# EAGLE schematic ESP32-S3 4G LTE CAT1 V1.1 (EAGLE 6.1)
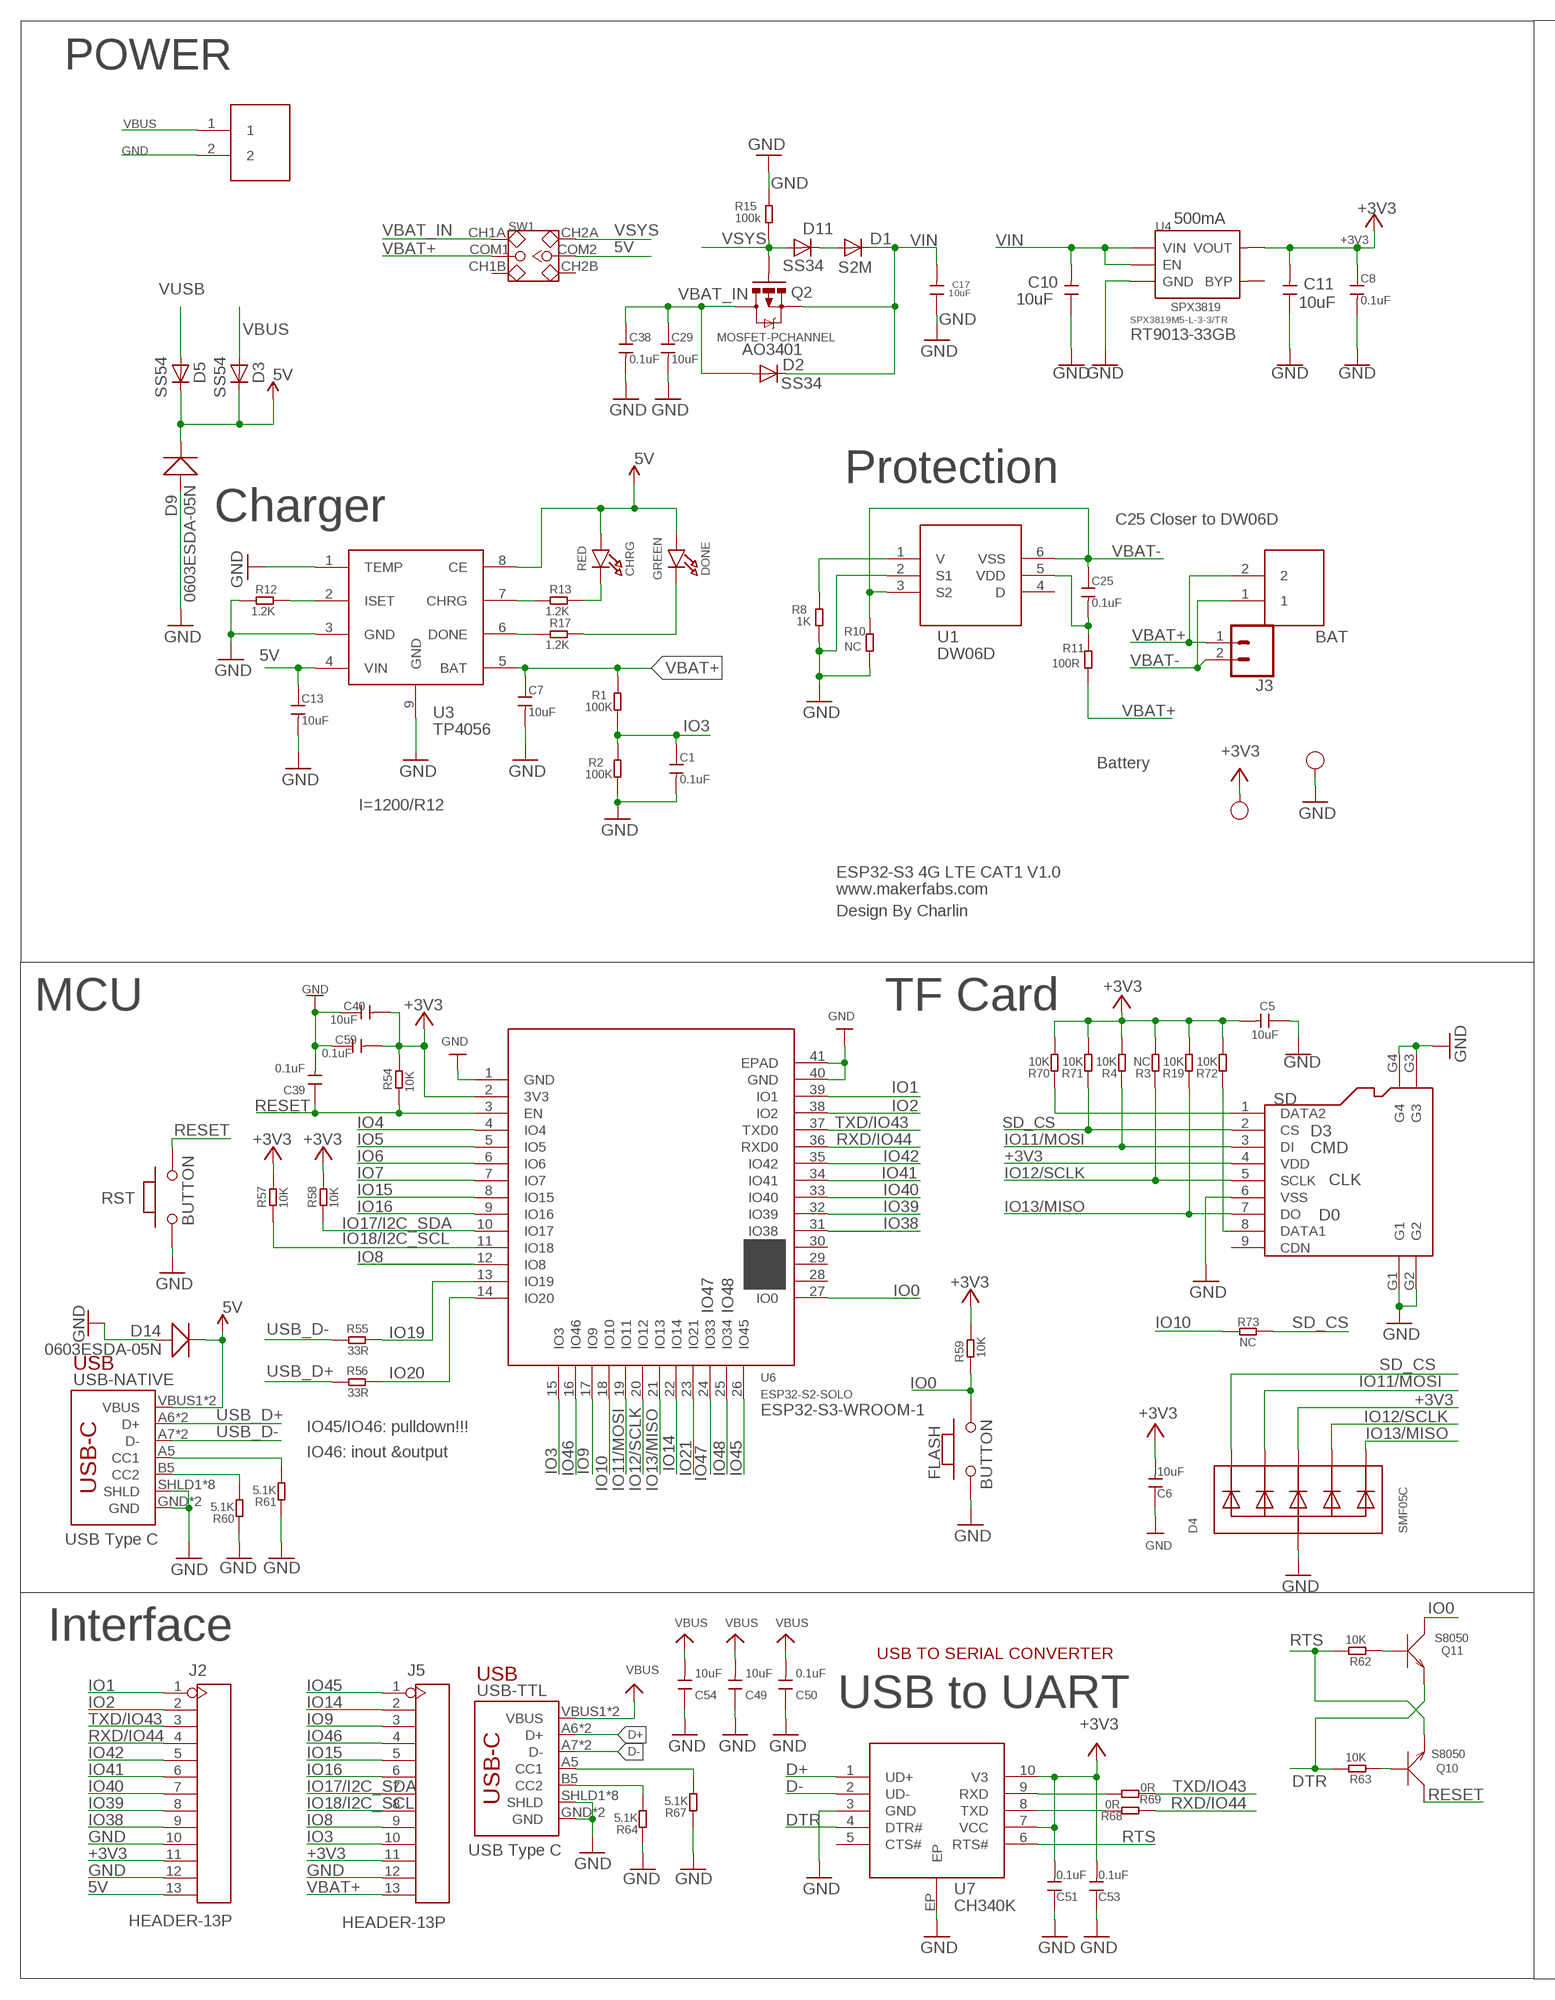
[diagram p0: schematic, sheet 1, part 1 of 2]
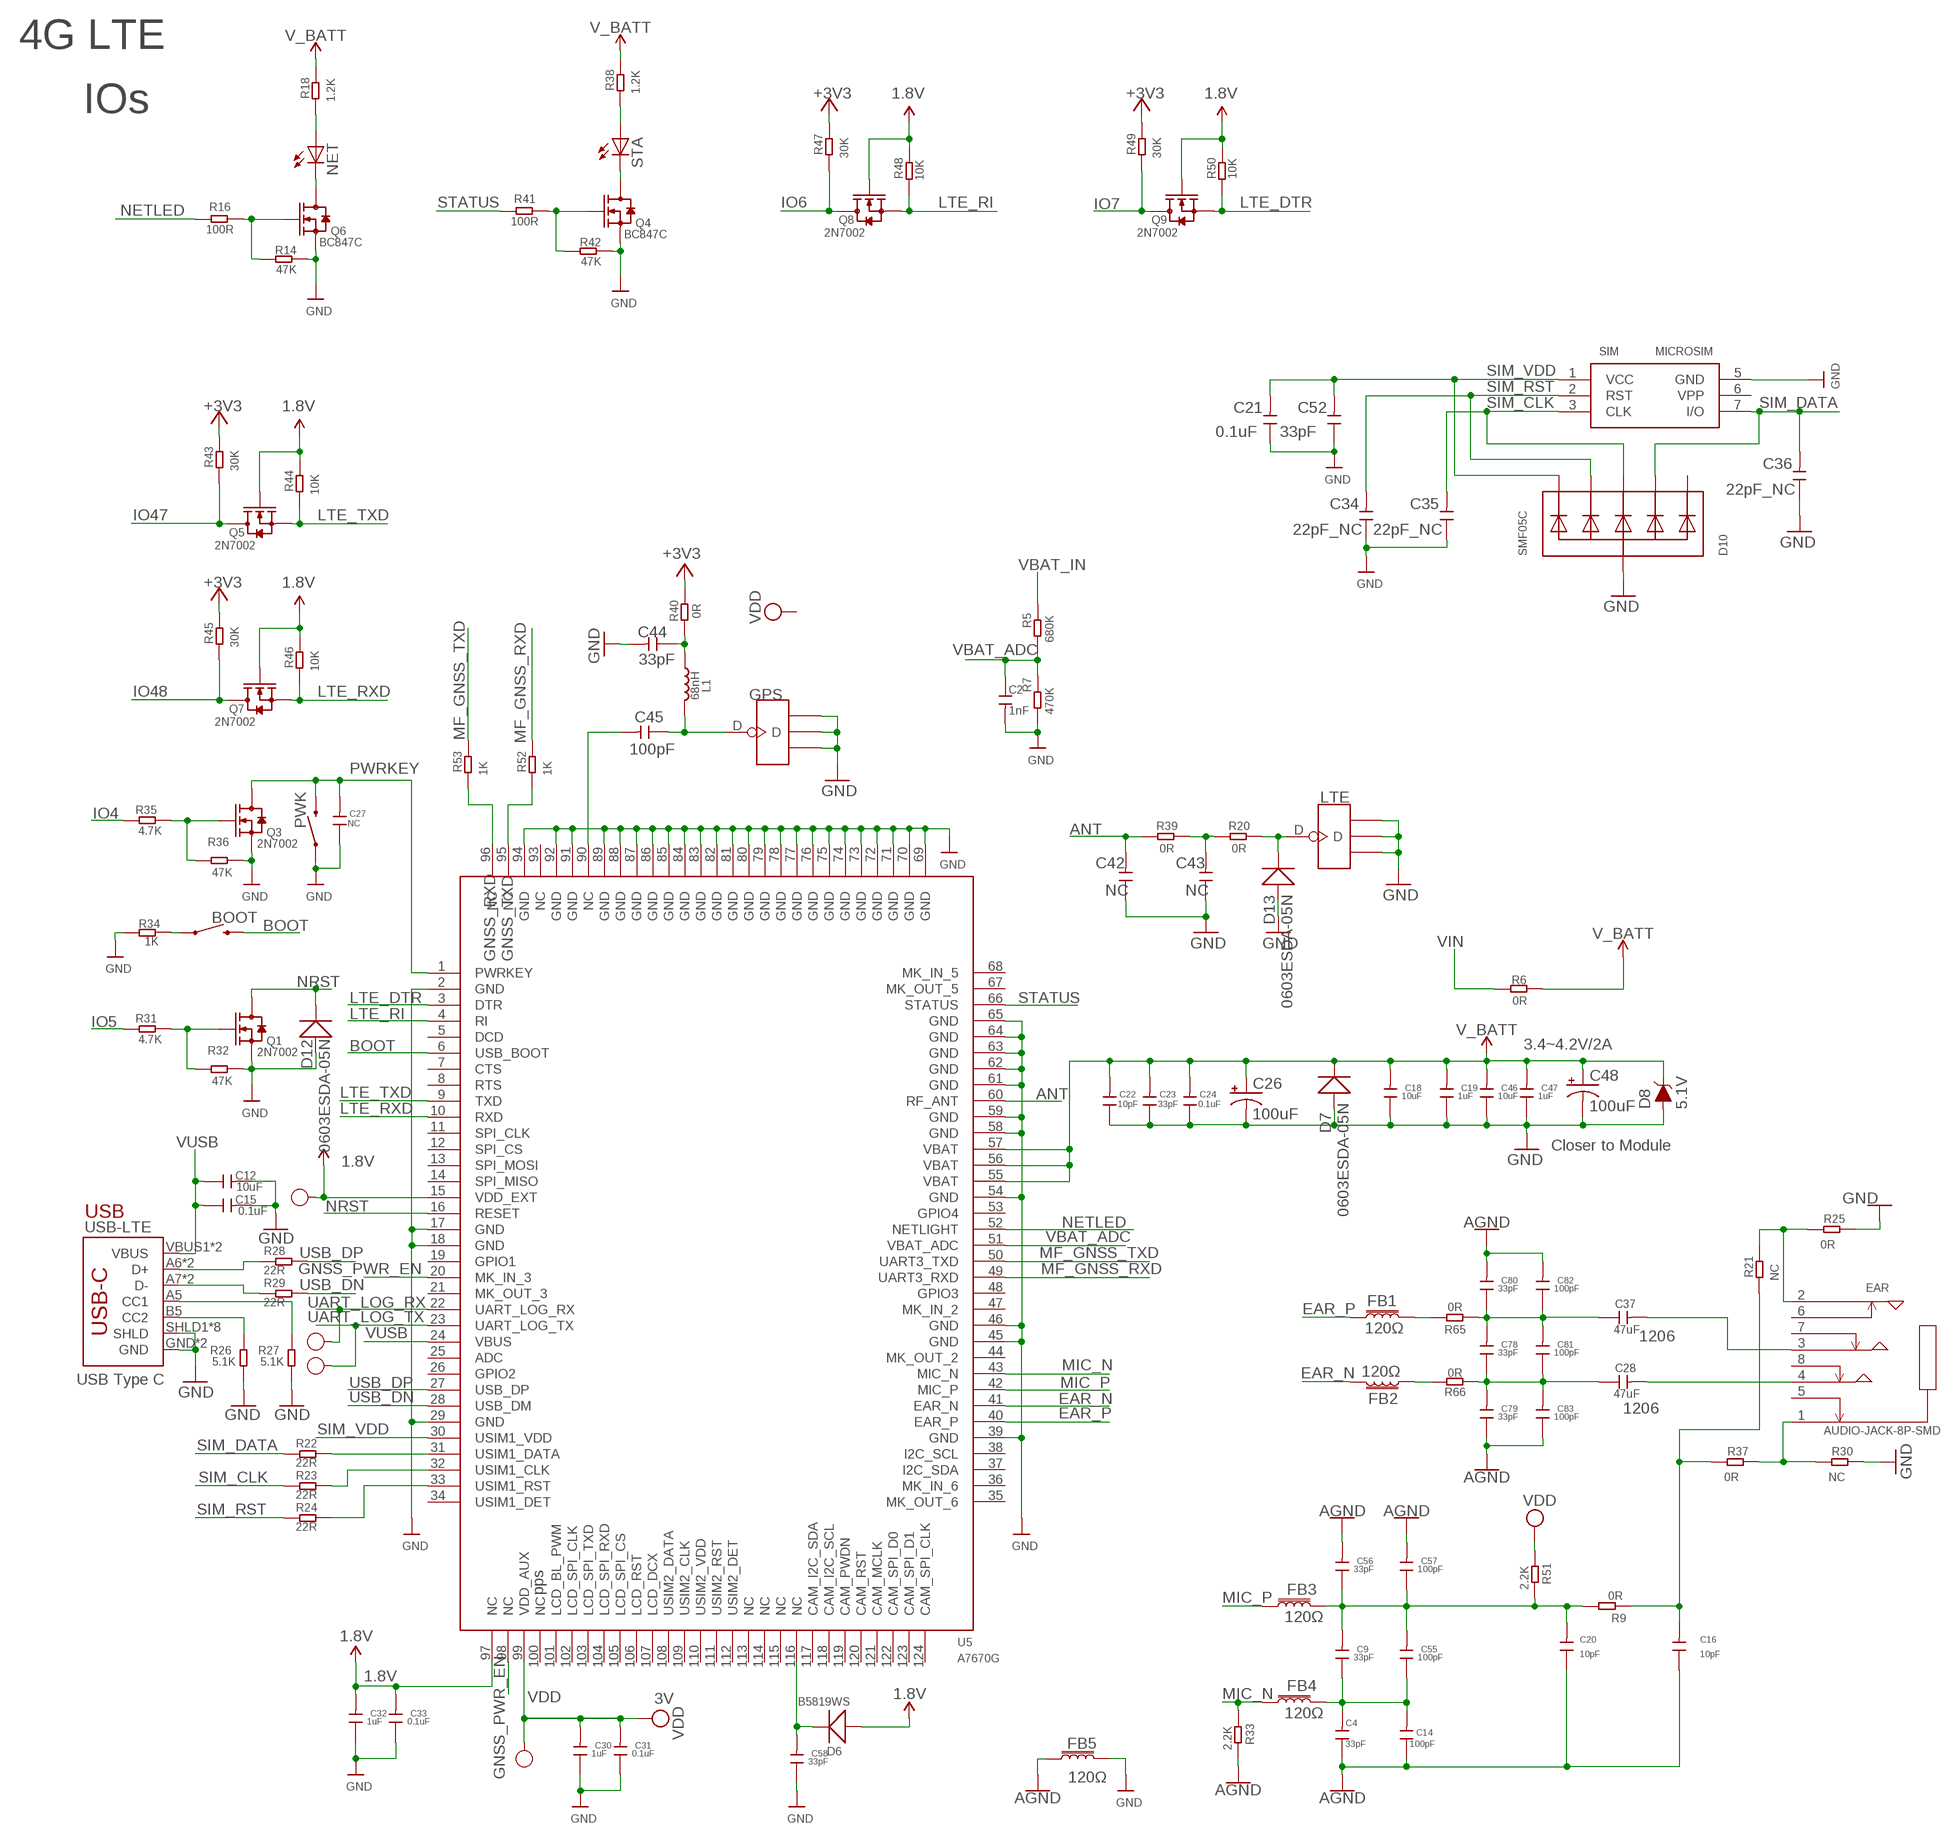
[diagram p1: schematic, sheet 1, part 2 of 2]

## Parts
1V8  TEST-POINT'4545'  [TP-D45MIL]
3V  TEST-POINT'4545'  [TP-D45MIL]
3V3  TEST-POINT'4545'  [TP-D45MIL]
BAT  PH2.0-2P-90-DIP  [PH2.0-2P-90-DIP]
BOOT  MOMENTARY-SWITCH-SPST-SMD-6.0X3.5MM  [TACTILE_SWITCH_SMD_6.0X3.5MM]
C1  0.1uF  C-0603  [0603]
C2  1nF  C-0603  [0603]
C4  33pF  C-0603  [0603]
C5  10uF  DISCRETE_C-0603  [DISCRETE_C0603]
C6  10uF  DISCRETE_C-0603  [DISCRETE_C0603]
C7  10uF  C-0603  [0603]
C8  0.1uF  C-0603  [0603]
C9  33pF  C-0603  [0603]
C10  10uF  C-0603  [0603]
C11  10uF  C-0603  [0603]
C12  10uF  C-0603  [0603]
C13  10uF  C-0603  [0603]
C14  100pF  C-0603  [0603]
C15  0.1uF  C-0603  [0603]
C16  10pF  C-0603  [0603]
C17  10uF  C-0603  [0603]
C18  10uF  C-0603  [0603]
C19  1uF  C-0603  [0603]
C20  10pF  C-0603  [0603]
C21  0.1uF  C-0603  [0603]
C22  10pF  C-0603  [0603]
C23  33pF  C-0603  [0603]
C24  0.1uF  C-0603  [0603]
C25  0.1uF  C-0603  [0603]
C26  100uF  68UF-POLAR-EIA3528-10V-10%(TANT)  [EIA3528]
C27  NC  C-0603  [0603]
C28  47uF  DISCRETE_C-1206  [DISCRETE_C1206]
C29  10uF  C-0603  [0603]
C30  1uF  C-0603  [0603]
C31  0.1uF  C-0603  [0603]
C32  1uF  C-0603  [0603]
C33  0.1uF  C-0603  [0603]
C34  22pF_NC  C-0603  [0603]
C35  22pF_NC  C-0603  [0603]
C36  22pF_NC  C-0603  [0603]
C37  47uF  DISCRETE_C-1206  [DISCRETE_C1206]
C38  0.1uF  C-0603  [0603]
C39  0.1uF  DISCRETE_C-0603  [DISCRETE_C0603]
C40  10uF  DISCRETE_C-0603  [DISCRETE_C0603]
C42  NC  C-0603  [0603]
C43  NC  C-0603  [0603]
C44  33pF  C-0603  [0603]
C45  100pF  C-0603  [0603]
C46  10uF  C-0603  [0603]
C47  1uF  C-0603  [0603]
C48  100uF  68UF-POLAR-EIA3528-10V-10%(TANT)  [EIA3528]
C49  10uF  DISCRETE_C-0603  [DISCRETE_C0603]
C50  0.1uF  DISCRETE_C-0603  [DISCRETE_C0603]
C51  0.1uF  DISCRETE_C-0603  [DISCRETE_C0603]
C52  33pF  C-0603  [0603]
C53  0.1uF  DISCRETE_C-0603  [DISCRETE_C0603]
C54  10uF  DISCRETE_C-0603  [DISCRETE_C0603]
C55  100pF  C-0603  [0603]
C56  33pF  C-0603  [0603]
C57  100pF  C-0603  [0603]
C58  33pF  C-0603  [0603]
C59  0.1uF  DISCRETE_C-0603  [DISCRETE_C0603]
C78  33pF  C-0603  [0603]
C79  33pF  C-0603  [0603]
C80  33pF  C-0603  [0603]
C81  100pF  C-0603  [0603]
C82  100pF  C-0603  [0603]
C83  100pF  C-0603  [0603]
CHRG  RED  LED0805_NOOUTLINE  [CHIPLED_0805_NOOUTLINE]
D1  S2M  DIODE-DO-214AC  [DO-214AC]
D2  SS34  DIODE-DO-214AC  [DO-214AC]
D3  SS54  DIODE-DO-214AC  [DO-214AC]
D4  SMF05C  TVSARRAY_5LANE  [SOT363]
D5  SS54  DIODE-DO-214AC  [DO-214AC]
D6  B5819WS  D'0805'  [SOD323]
D7  0603ESDA-05N  DISCRETE_D0603  [DISCRETE_SOD523]
D8  5.1V  DIODE-ZENER-MMSZ5232BS  [SOD-323]
D9  0603ESDA-05N  DISCRETE_D0603  [DISCRETE_SOD523]
D10  SMF05C  TVSARRAY_5LANE  [SOT363]
D11  SS34  DIODE-DO-214AC  [DO-214AC]
D12  0603ESDA-05N  DISCRETE_D0603  [DISCRETE_SOD523]
D13  0603ESDA-05N  DISCRETE_D0603  [DISCRETE_SOD523]
D14  0603ESDA-05N  DISCRETE_D0603  [DISCRETE_SOD523]
DONE  GREEN  LED0805_NOOUTLINE  [CHIPLED_0805_NOOUTLINE]
EAR  AUDIO-JACK-8P-SMD  AUDIO-JACK-8P-SMD'PJ-393'  [AUDIO8P-SMD-3.5-14.5X6.1X4.0MM]
FB1  120Ω  FERRITE_BEAD-0603  [0603]
FB2  120Ω  FERRITE_BEAD-0603  [0603]
FB3  120Ω  FERRITE_BEAD-0603  [0603]
FB4  120Ω  FERRITE_BEAD-0603  [0603]
FB5  120Ω  FERRITE_BEAD-0603  [0603]
FLASH  BUTTON  PB157  [157SW]
GND  TEST-POINT'4545'  [TP-D45MIL]
GPS  ANTENNA-U-FL  [4P-U-FL]
J1  PH2.0-2P-90-DIP  [PH2.0-2P-90-DIP]
J2  HEADER-13P  [13P-2.54]
J3  CONN_02LOCK  [1X02_LOCK]
J5  HEADER-13P  [13P-2.54]
L1  68nH  L'0603'  [L0603]
LTE  ANTENNA-U-FL  [4P-U-FL]
NET  NET  LEDCHIP-LED0805  [CHIP-LED0805]
PWK  MOMENTARY-SWITCH-SPST-SMD-6.0X3.5MM  [TACTILE_SWITCH_SMD_6.0X3.5MM]
Q1  2N7002  MOSFET-N'SOT23'  [SOT23]
Q2  MOSFET-PCHANNEL  [SOT23-3]
Q3  2N7002  MOSFET-N'SOT23'  [SOT23]
Q4  BC847C  MOSFET-N'SOT23'  [SOT23]
Q5  2N7002  MOSFET-N'SOT23'  [SOT23]
Q6  BC847C  MOSFET-N'SOT23'  [SOT23]
Q7  2N7002  MOSFET-N'SOT23'  [SOT23]
Q8  2N7002  MOSFET-N'SOT23'  [SOT23]
Q9  2N7002  MOSFET-N'SOT23'  [SOT23]
Q10  S8050  TRANSISTOR-NPN-SOT23  [SOT23]
Q11  S8050  TRANSISTOR-NPN-SOT23  [SOT23]
R1  100K  R-0603  [R0603]
R2  100K  R-0603  [R0603]
R3  NC  DISCRETE_R-0603  [DISCRETE_R0603]
R4  10K  DISCRETE_R-0603  [DISCRETE_R0603]
R5  680K  R-0603  [R0603]
R6  0R  R-0603  [R0603]
R7  470K  R-0603  [R0603]
R8  1K  R-0603  [R0603]
R9  0R  R-0603  [R0603]
R10  NC  R-0603  [R0603]
R11  100R  R-0603  [R0603]
R12  1.2K  R-0603  [R0603]
R13  1.2K  R-0603  [R0603]
R14  47K  R-0603  [R0603]
R15  100k  R-0603  [R0603]
R16  100R  R-0603  [R0603]
R17  1.2K  R-0603  [R0603]
R18  1.2K  R-0603  [R0603]
R19  10K  DISCRETE_R-0603  [DISCRETE_R0603]
R20  0R  R-0603  [R0603]
R21  NC  R-0603  [R0603]
R22  22R  R-0603  [R0603]
R23  22R  R-0603  [R0603]
R24  22R  R-0603  [R0603]
R25  0R  R-0603  [R0603]
R26  5.1K  R-0603  [R0603]
R27  5.1K  R-0603  [R0603]
R28  22R  R-0603  [R0603]
R29  22R  R-0603  [R0603]
R30  NC  R-0603  [R0603]
R31  4.7K  R-0603  [R0603]
R32  47K  R-0603  [R0603]
R33  2.2K  R-0603  [R0603]
R34  1K  R-0603  [R0603]
R35  4.7K  R-0603  [R0603]
R36  47K  R-0603  [R0603]
R37  0R  R-0603  [R0603]
R38  1.2K  R-0603  [R0603]
R39  0R  R-0603  [R0603]
R40  0R  R-0603  [R0603]
R41  100R  R-0603  [R0603]
R42  47K  R-0603  [R0603]
R43  30K  R-0603  [R0603]
R44  10K  R-0603  [R0603]
R45  30K  R-0603  [R0603]
R46  10K  R-0603  [R0603]
R47  30K  R-0603  [R0603]
R48  10K  R-0603  [R0603]
R49  30K  R-0603  [R0603]
R50  10K  R-0603  [R0603]
R51  2.2K  R-0603  [R0603]
R52  1K  R-0603  [R0603]
R53  1K  R-0603  [R0603]
R54  10K  R-0603  [R0603]
R55  33R  R-0603  [R0603]
R56  33R  R-0603  [R0603]
R57  10K  R-0603  [R0603]
R58  10K  R-0603  [R0603]
R59  10K  R-0603  [R0603]
R60  5.1K  DISCRETE_R-0603  [DISCRETE_R0603]
R61  5.1K  DISCRETE_R-0603  [DISCRETE_R0603]
R62  10K  R-0603  [R0603]
R63  10K  R-0603  [R0603]
R64  5.1K  DISCRETE_R-0603  [DISCRETE_R0603]
R65  0R  R-0603  [R0603]
R66  0R  R-0603  [R0603]
R67  5.1K  DISCRETE_R-0603  [DISCRETE_R0603]
R68  0R  R-0603  [R0603]
R69  0R  R-0603  [R0603]
R70  10K  DISCRETE_R-0603  [DISCRETE_R0603]
R71  10K  DISCRETE_R-0603  [DISCRETE_R0603]
R72  10K  DISCRETE_R-0603  [DISCRETE_R0603]
R73  NC  R-0603  [R0603]
RST  BUTTON  PB157  [157SW]
RX  TEST-POINT'4545'  [TP-D45MIL]
SD  HOLDER-MICROSD-9P  [9P-SMD-W/-RING]
SIM  MICROSIM  [MICROSIM]
STA  NET  LEDCHIP-LED0805  [CHIP-LED0805]
SW1  SWITCH-2CH-6P  [6P-2CH-2.54-7.6X3.0]
TX  TEST-POINT'4545'  [TP-D45MIL]
U1  DW06D  [SOT-23-6]
U3  TP4056  [SOP8-1.27P]
U4  SPX3819  [SOT23-5]
U5  A7670G  [A7670G]
U6  ESP32­S2­SOLO  [ESP32-­S2-­SOLO]
U7  CH340K  [ESOP-10-EP-150MIL]
USB-LTE  USB_C5  [USB-C-16P-5]
USB-NATIVE  USB_C5  [USB-C-16P-5]
USB-TTL  USB_C5  [USB-C-16P-5]

## Nets
1.8V: 1V8.T C32.2 C33.2 D6.+ Q5.1(G) Q7.1(G) Q8.1(G) Q9.1(G) R44.2 R46.2 R48.2 R50.2 U5.15(VDD_EXT) U5.97(NC)
5V: C13.1 CHRG.A D3.C D5.C D9.- D14.- DONE.A J2.13 SW1.COM2 U3.4(VIN) U3.8(CE) USB-NATIVE.VBUS1(VBUS) USB-NATIVE.VBUS2(VBUS)
+3V3: 3V3.T C5.2 C6.2 C8.1 C11.2 C40.2 C51.2 C53.2 C59.2 D4.4(C3) J2.11 J5.11 R3.2 R4.2 R19.2 R40.2 R43.2 R45.2 R47.2 R49.2 R54.2 R57.2 R58.2 R59.2 R70.2 R71.2 R72.2 SD.4(VDD) U4.5(VOUT) U6.2(3V3) U7.7(VCC) U7.10(V3)
AGND: C4.1 C14.1 C16.1 C20.1 C56.2 C57.2 C79.1 C80.2 C82.2 C83.1 FB5.1 R33.2
ANT: C42.2 R39.1 U5.60(RF_ANT)
BOOT: BOOT.2 U5.6(USB_BOOT)
D+: U7.1(UD+) USB-TTL.A6(D+) USB-TTL.B6(D+)
D-: U7.2(UD-) USB-TTL.A7(D-) USB-TTL.B7(D-)
DONE: R17.2 U3.6(DONE)
DTR: Q11.2(E) R63.2 U7.4(DTR#)
EAR_N: FB2.2 U5.41(EAR_N)
EAR_P: FB1.1 U5.40(EAR_P)
GND: C1.2 C2.2 C5.1 C6.1 C7.2 C8.2 C10.1 C11.1 C12.2 C13.2 C15.2 C17.1 C18.1 C19.1 C21.1 C22.1 C23.1 C24.1 C26.C(-) C27.1 C29.2 C30.1 C31.1 C32.1 C33.1 C34.1 C35.1 C36.1 C38.2 C39.2 C40.1 C42.1 C43.1 C44.2 C46.1 C47.1 C48.C(-) C49.1 C50.1 C51.1 C52.1 C53.1 C54.1 C58.1 C59.1 D4.2(A) D7.+ D8.A D9.+ D10.2(A) D12.+ D13.+ D14.+ FB5.2 FLASH.1 GND.T GPS.GND1 GPS.GND2 GPS.GND3 J1.2 J2.10 J2.12 J5.12 LTE.GND1 LTE.GND2 LTE.GND3 PWK.1 Q1.2(S) Q3.2(S) Q4.2(S) Q6.2(S) R2.1 R7.1 R8.1 R10.1 R12.2 R14.1 R15.2 R25.2 R26.1 R27.1 R30.2 R32.1 R34.2 R36.1 R42.1 R60.1 R61.1 R64.1 R67.1 RST.1 SD.6(VSS) SD.G1 SD.G2 SD.G3 SD.G4 SIM.5(GND) U1.2(S1) U3.1(TEMP) U3.3(GND) U3.9(GND) U4.2(GND) U5.2(GND) U5.17(GND) U5.18(GND) U5.29(GND) U5.39(GND) U5.45(GND) U5.46(GND) U5.54(GND) U5.58(GND) U5.59(GND) U5.61(GND) U5.62(GND) U5.63(GND) U5.64(GND) U5.65(GND) U5.69(GND) U5.70(GND) U5.71(GND) U5.72(GND) U5.73(GND) U5.74(GND) U5.75(GND) U5.76(GND) U5.77(GND) U5.78(GND) U5.79(GND) U5.80(GND) U5.81(GND) U5.82(GND) U5.83(GND) U5.84(GND) U5.85(GND) U5.86(GND) U5.87(GND) U5.88(GND) U5.89(GND) U5.91(GND) U5.92(GND) U5.94(GND) U6.1(GND) U6.40(GND) U6.41(EPAD) U7.3(GND) U7.EP USB-LTE.GND USB-LTE.GND2(GND) USB-LTE.SHLD1(SHLD) USB-LTE.SHLD2(SHLD) USB-LTE.SHLD3(SHLD) USB-LTE.SHLD4(SHLD) USB-LTE.SHLD5(SHLD) USB-LTE.SHLD6(SHLD) USB-LTE.SHLD7(SHLD) USB-LTE.SHLD8(SHLD) USB-NATIVE.GND USB-NATIVE.GND2(GND) USB-NATIVE.SHLD1(SHLD) USB-NATIVE.SHLD2(SHLD) USB-NATIVE.SHLD3(SHLD) USB-NATIVE.SHLD4(SHLD) USB-NATIVE.SHLD5(SHLD) USB-NATIVE.SHLD6(SHLD) USB-NATIVE.SHLD7(SHLD) USB-NATIVE.SHLD8(SHLD) USB-TTL.GND USB-TTL.GND2(GND) USB-TTL.SHLD1(SHLD) USB-TTL.SHLD2(SHLD) USB-TTL.SHLD3(SHLD) USB-TTL.SHLD4(SHLD) USB-TTL.SHLD5(SHLD) USB-TTL.SHLD6(SHLD) USB-TTL.SHLD7(SHLD) USB-TTL.SHLD8(SHLD)
GNSS_PWR_EN: U5.20(MK_IN_3) U5.98(NC)
IO0: FLASH.2 Q11.3(C) R59.1 U6.27(IO0)
IO1: J2.1 U6.39(IO1)
IO2: J2.2 U6.38(IO2)
IO3: C1.1 J5.10 R1.1 R2.2 U6.15(IO3)
IO4: R35.2 U6.4(IO4)
IO5: R31.2 U6.5(IO5)
IO6: Q8.3(D) R47.1 U6.6(IO6)
IO7: Q9.3(D) R49.1 U6.7(IO7)
IO8: J5.9 U6.12(IO8)
IO9: J5.3 U6.17(IO9)
IO10: R73.1 U6.18(IO10)
IO11/MOSI: D4.3(C2) R4.1 SD.3(DI) U6.19(IO11)
IO12/SCLK: D4.5(C4) R3.1 SD.5(SCLK) U6.20(IO12)
IO13/MISO: D4.6(C5) R19.1 SD.7(DO) U6.21(IO13)
IO14: J5.2 U6.22(IO14)
IO15: J5.5 U6.8(IO15)
IO16: J5.6 U6.9(IO16)
IO17/I2C_SDA: J5.7 R58.1 U6.10(IO17)
IO18/I2C_SCL: J5.8 R57.1 U6.11(IO18)
IO19: R55.2 U6.13(IO19)
IO20: R56.2 U6.14(IO20)
IO21: U6.23(IO21)
IO38: J2.9 U6.31(IO38)
IO39: J2.8 U6.32(IO39)
IO40: J2.7 U6.33(IO40)
IO41: J2.6 U6.34(IO41)
IO42: J2.5 U6.35(IO42)
IO45: J5.1 U6.26(IO45)
IO46: J5.4 U6.16(IO46)
IO47: Q5.3(D) R43.1 U6.24(IO33)
IO48: Q7.3(D) R45.1 U6.25(IO34)
ISET: R12.1 U3.2(ISET)
LTE_DTR: Q9.2(S) R50.1 U5.3(DTR)
LTE_RI: Q8.2(S) R48.1 U5.4(RI)
LTE_RXD: Q7.2(S) R46.1 U5.10(RXD)
LTE_TXD: Q5.2(S) R44.1 U5.9(TXD)
MF_GNSS_RXD: R52.2 U5.49(UART3_RXD)
MF_GNSS_TXD: R53.2 U5.50(UART3_TXD)
MIC_N: FB4.1 R33.1 U5.43(MIC_N)
MIC_P: FB3.1 U5.42(MIC_P)
N$1: NET.C Q6.3(D)
N$2: CHRG.C R13.1
N$3: D13.- LTE.D R20.2
N$4: Q4.1(G) R41.1 R42.2
N$5: Q6.1(G) R14.2 R16.1
N$6: NET.A R18.1
N$7: R70.1 SD.1(DATA2)
N$8: BOOT.1 R34.1
N$9: C25.2 R11.2 U1.5(VDD)
N$10: R8.2 U1.1(V)
N$11: DONE.C R17.1
N$12: R13.2 U3.7(CHRG)
N$13: D1.A D11.C
N$14: C16.2 R9.1 R21.1 R37.1
N$15: C9.2 C20.2 C55.2 C56.1 C57.1 FB3.2 R9.2 R51.2
N$16: EAR.2 R21.2 R25.1
N$17: FB2.1 R66.2
N$18: R72.1 SD.8(DATA1)
N$19: C58.2 D6.- U5.116(NC)
N$20: EAR.1 R30.1 R37.2
N$21: C28.1 C78.1 C79.2 C81.1 C83.2 R66.1
N$22: R22.1 U5.31(USIM1_DATA)
N$23: R23.1 U5.32(USIM1_CLK)
N$24: R24.1 U5.33(USIM1_RST)
N$25: C4.2 C9.1 C14.2 C55.1 FB4.2
N$27: R27.2 USB-LTE.A5(CC1)
N$28: R26.2 USB-LTE.B5(CC2)
N$29: R38.1 STA.A
N$30: Q4.3(D) STA.C
N$31: C37.1 C78.2 C80.1 C81.2 C82.1 R65.1
N$32: R28.2 USB-LTE.A6(D+) USB-LTE.B6(D+)
N$33: R29.2 USB-LTE.A7(D-) USB-LTE.B7(D-)
N$34: Q1.1(G) R31.1 R32.2
N$35: C45.2 U5.90(NC)
N$36: C28.2 EAR.4
N$37: R52.1 U5.95(NC)
N$38: R53.1 U5.96(NC)
N$41: R61.2 USB-NATIVE.A5(CC1)
N$42: R60.2 USB-NATIVE.B5(CC2)
N$43: Q3.1(G) R35.1 R36.2
N$44: Q10.1(B) R63.1
N$45: Q11.1(B) R62.1
N$46: R67.2 USB-TTL.A5(CC1)
N$47: R64.2 USB-TTL.B5(CC2)
N$48: R69.2 U7.9(RXD)
N$49: R68.2 U7.8(TXD)
N$59: FB1.2 R65.2
N$64: C37.2 EAR.3
N$72: C43.2 R20.1 R39.2
N$73: C44.1 L1.1 R40.1
N$76: C45.1 GPS.D L1.2
NETLED: R16.2 U5.52(NETLIGHT)
NRST: D12.- Q1.3(D) U5.16(RESET)
PWRKEY: C27.2 PWK.2 Q3.3(D) U5.1(PWRKEY)
RESET: C39.1 Q10.3(C) R54.1 RST.2 U6.3(EN)
RTS: Q10.2(E) R62.2 U7.6(RTS#)
RXD/IO44: J2.4 R68.1 U6.36(RXD0)
SD_CS: D4.1(C1) R71.1 R73.2 SD.2(CS)
SIM_CLK: C35.2 D10.4(C3) R23.2 SIM.3(CLK)
SIM_DATA: C36.2 D10.3(C2) R22.2 SIM.7(I/O)
SIM_RST: C34.2 D10.5(C4) R24.2 SIM.2(RST)
SIM_VDD: C21.2 C52.2 D10.6(C5) SIM.1(VCC) U5.30(USIM1_VDD)
STATUS: R41.2 U5.66(STATUS)
TXD/IO43: J2.3 R69.1 U6.37(TXD0)
UART_LOG_RX: RX.T U5.22(UART_LOG_RX)
UART_LOG_TX: TX.T U5.23(UART_LOG_TX)
USB_D+: R56.1 USB-NATIVE.A6(D+) USB-NATIVE.B6(D+)
USB_D-: R55.1 USB-NATIVE.A7(D-) USB-NATIVE.B7(D-)
USB_DN: R29.1 U5.28(USB_DM)
USB_DP: R28.1 U5.27(USB_DP)
V_BATT: C18.2 C19.2 C22.2 C23.2 C24.2 C26.A(+) C46.2 C47.2 C48.A(+) D7.- D8.C R6.1 R18.2 R38.2 U5.55(VBAT) U5.56(VBAT) U5.57(VBAT)
VBAT+: BAT.2 C7.1 J3.1 J5.13 R1.2 R11.1 SW1.COM1 U3.5(BAT)
VBAT-: BAT.1 C25.1 J3.2 R10.2 U1.3(S2) U1.6(VSS)
VBAT_ADC: C2.1 R5.1 R7.2 U5.51(VBAT_ADC)
VBAT_IN: C29.1 C38.1 D2.A Q2.3(D) R5.2 SW1.CH1A
VBUS: C49.2 C50.2 C54.2 D3.A J1.1 USB-TTL.VBUS1(VBUS) USB-TTL.VBUS2(VBUS)
VDD: 3V.T C30.2 C31.2 R51.1 U5.99(VDD_AUX)
VIN: C10.2 C17.2 D1.C D2.C Q2.2(S) R6.2 U4.1(VIN) U4.3(EN)
VSYS: D11.A Q2.1(G) R15.1 SW1.CH2A
VUSB: C12.1 C15.1 D5.A U5.24(VBUS) USB-LTE.VBUS1(VBUS) USB-LTE.VBUS2(VBUS)
Unconnected: D10.1(C1) EAR.5 EAR.6 EAR.7 EAR.8 SD.9(CDN) SIM.6(VPP) SW1.CH1B SW1.CH2B U1.4(D) U4.4(BYP) U5.5(DCD) U5.7(CTS) U5.8(RTS) U5.11(SPI_CLK) U5.12(SPI_CS) U5.13(SPI_MOSI) U5.14(SPI_MISO) U5.19(GPIO1) U5.21(MK_OUT_3) U5.25(ADC) U5.26(GPIO2) U5.34(USIM1_DET) U5.35(MK_OUT_6) U5.36(MK_IN_6) U5.37(I2C_SDA) U5.38(I2C_SCL) U5.44(MK_OUT_2) U5.47(MK_IN_2) U5.48(GPIO3) U5.53(GPIO4) U5.67(MK_OUT_5) U5.68(MK_IN_5) U5.93(NC) U5.100(NC) U5.101(LCD_BL_PWM) U5.102(LCD_SPI_CLK) U5.103(LCD_SPI_TXD) U5.104(LCD_SPI_RXD) U5.105(LCD_SPI_CS) U5.106(LCD_RST) U5.107(LCD_DCX) U5.108(USIM2_DATA) U5.109(USIM2_CLK) U5.110(USIM2_VDD) U5.111(USIM2_RST) U5.112(USIM2_DET) U5.113(NC) U5.114(NC) U5.115(NC) U5.117(CAM_I2C_SDA) U5.118(CAM_I2C_SCL) U5.119(CAM_PWDN) U5.120(CAM_RST) U5.121(CAM_MCLK) U5.122(CAM_SPI_D0) U5.123(CAM_SPI_D1) U5.124(CAM_SPI_CLK) U6.28(IO35) U6.29(IO36) U6.30(IO37) U7.5(CTS#)

## Notes on the sheet
- POWER
- 4G LTE
- IOs
- 500mA
- SPX3819M5-L-3-3/TR
- RT9013-33GB
- AO3401
- Protection
- Charger | C25 Closer to DW06D
- BAT
- Battery
- I=1200/R12
- ESP32-S3 4G LTE CAT1 V1.0
- www.makerfabs.com
- Design By Charlin
- MCU | TF Card
- GNSS_RXD | GNSS_TXD
- D3 | 3.4~4.2V/2A
- CMD
- CLK
- D0
- Closer to Module
- IO47 | IO48 | USB
- USB
- ESP32-S3-WROOM-1
- IO45/IO46: pulldown!!!
- 1206
- IO46: inout &output
- USB Type C
- 1206
- USB Type C
- Interface
- USB TO SERIAL CONVERTER
- USB
- USB to UART | pps
- 3V
- USB Type C

## Library data of the parts
1V8 3V 3V3 GND RX TX = Discrete-new:TEST-POINT; PARTNO: DNP
BAT J1 = Connector:PH2.0-2P-90-DIP
BOOT PWK = SparkFun-Switches:MOMENTARY-SWITCH-SPST: Momentary Switch (Pushbutton) - SPST Normally-open (NO) SPST momentary switches (buttons, pushbuttons). Variants PTH-12MM - 12mm square, through-hole Momentary Pushbutton Switch - 12mm Square <https://www.sparkfun.com/products/9190> (COM-09190) PTH-6.0MM, PTH-6.0MM-KIT - 6.0mm square, through-hole Mini Pushbutton Switch <https://www.sparkfun.com/products/97> (COM-00097) KIT package intended for soldering kit's - only one side of pads' copper is exposed. PTH-RIGHT-ANGLE-KIT - Right-angle, through-hole Right Angle Tactile Button <https://www.sparkfun.com/products/10791> - Used on SparkFun BigTime Watch Kit <https://www.sparkfun.com/products/11734> SMD-12MM - 12mm square, surface-mount Tactile Button - SMD (12mm) <https://www.sparkfun.com/products/12993> (COM-12993) Used on SparkFun PicoBoard <https://www.sparkfun.com/products/11888> SMD-4.5MM - 4.5mm Square Trackball Switch Used on SparkFun Blackberry Trackballer Breakout <https://www.sparkfun.com/products/13169> SMD-4.6MMX2.8MM - 4.60mm x 2.80mm, surface mount Used on SparkFun SAMD21 Mini Breakout <https://www.sparkfun.com/products/13664> SMD-5.2MM, SMD-5.2-REDUNDANT - 5.2mm square, surface-mount Mini Pushbutton Switch - SMD <https://www.sparkfun.com/products/8720> (COM-08720) Used on Arduino Pro Mini <https://www.sparkfun.com/products/11114> REDUNDANT package connects both switch circuits together SMD-6.0X3.5MM - 6.0 x 3.5mm, surface mount Momentary Reset Switch SMD <https://www.sparkfun.com/products/8229> (COM-08229) SMD-6.2MM-TALL - 6.2mm square, surface mount Tactile Button - SMD (6mm) <https://www.sparkfun.com/products/12992> Used on SparkFun Digital Sandbox <https://www.sparkfun.com/products/12651> SMD-RIGHT-ANGLE - Right-angle, surface mount Used on SparkFun Block for Intel® Edison - Arduino <https://www.sparkfun.com/products/13036>; PROD_ID: SWCH-00815; SF_SKU: COM-08229
C1 C2 C4 C7-C25 C27 C29-C36 C38 C42-C47 C52 C55-C58 C78-C83 = Discrete:C*: Ceramic Capacitors
C5 C6 C28 C37 C39 C40 C49-C51 C53 C54 C59 = A9G:DISCRETE_C*: Ceramic Capacitors
C26 C48 = SparkFun-Capacitors:68UF-POLAR: 68µF polarized capacitors A capacitor is a passive two-terminal electrical component used to store electrical energy temporarily in an electric field.; PROD_ID: CAP-10790; VALUE: 68uF
CHRG DONE = microbuilder:LED: LED
D1-D3 D5 D11 = diode:DIODE-: DIODE
D4 D10 = microbuilder:TVSARRAY_5LANE: Voltage Transient Suppressor Array SOT363 SMF05C - 100W 5V: Digikey - SMF05CT1GOSCT-ND
D6 = Discrete:D*
D7 D9 D12-D14 = L:DISCRETE_D*
D8 = SparkFun-DiscreteSemi:DIODE-ZENER: Zener Diode A Zener diode allows current to flow from its anode to its cathode like a normal semiconductor diode, but it also permits current to flow in the reverse direction when its "Zener voltage" is reached. - WIkipedia; PROD_ID: DIO-12442; VALUE: 5.6V
EAR = Connector-new:AUDIO-JACK-8P-SMD: 320040009
FB1-FB5 = SparkFun-Coils:FERRITE_BEAD: Ferrite Bead (blocks, cores, rings, chokes, etc.) Inductor with layers of ferrite used to suppress high frequencies. Often used to isolate high frequency noise. SparkFun Products: IOIO-OTG - V2.2 <https://www.sparkfun.com/products/13613> SparkFun SAMD21 Mini Breakout <https://www.sparkfun.com/products/13664> SparkFun 6 Degrees of Freedom Breakout - LSM6DS3 <https://www.sparkfun.com/products/13339> SparkFun SAMD21 Dev Breakout <https://www.sparkfun.com/products/13672>; PROD_ID: NDUC-13805; VALUE: 30Ω/1.8A
FLASH RST = MySMD:PB157
GPS LTE = Connector:ANTENNA-U-FL
J2 J5 = Connector:HEADER-13P
J3 = SparkFun-Connectors:CONN_02: Multi connection point. Often used as Generic Header-pin footprint for 0.1 inch spaced/style header connections On any of the 0.1 inch spaced packages, you can populate with these: Break Away Headers - Straight <https://www.sparkfun.com/products/116> (PRT-00116) Break Away Male Headers - Right Angle <https://www.sparkfun.com/products/553> (PRT-00553) Female Headers <https://www.sparkfun.com/products/115> (PRT-00115) Break Away Headers - Machine Pin <https://www.sparkfun.com/products/117> (PRT-00117) Break Away Female Headers - Swiss Machine Pin <https://www.sparkfun.com/products/743> (PRT-00743) For SCREWTERMINALS and SPRING TERMINALS visit here: Screw Terimnals on SparkFun.com <https://www.sparkfun.com/search/results?term=Screw+Terminals> (5mm/3.5mm/2.54mm spacing) This device is also useful as a general connection point to wire up your design to another part of your project. Our various solder wires solder well into these plated through hole pads. Hook-Up Wire - Assortment (Stranded, 22 AWG) <https://www.sparkfun.com/products/11375> (PRT-11375) Hook-Up Wire - Assortment (Solid Core, 22 AWG) <https://www.sparkfun.com/products/11367> (PRT-11367) View the entire wire category on our website here <https://www.sparkfun.com/categories/141> Special notes: Molex polarized connector foot print use with: PRT-08233 with associated crimp pins and housings. 2.54_SCREWTERM for use with PRT-10571. 3.5mm Screw Terminal footprints for PRT-08084 5mm Screw Terminal footprints for use with PRT-08432
L1 = Discrete:L*
NET STA = adafruit2:LED: LED
Q1 Q3-Q9 = Discrete:MOSFET-N: IRLL014: http://www.vishay.com/docs/91319/sihll014.pdf
Q2 = User-Submitted:MOSFET-PCHANNEL: Generic PMOSFET IRLML2244 - TRANS-11153 (SOT-23 -20V -4.3A) (1.Gate 2.Source 3.Drain) FQP27P06 - COM-10349 <http://www.sparkfun.com/products/10349> (TO-220 -60V -27A) (1.Gate 2.Source 3.Drain); PROD_ID: TRANS-08285
Q10 Q11 = Discrete:TRANSISTOR-NPN*: NPN audion
R1 R2 R5-R18 R20-R59 R62 R63 R65 R66 R68 R69 R73 = Discrete:R*
R3 R4 R19 R60 R61 R64 R67 R70-R72 = A9G:DISCRETE_R*
SD = Connector:HOLDER-MICROSD-9P
SIM = Connector:MICROSIM
SW1 = Discrete:SWITCH-2CH-6P
U1 = self:DW06D
U3 = self:TP4056
U4 = IC:SPX3819
U5 = sale:A7670G
U6 = self:ESP32­S2­SOLO
U7 = sale:CH340K
USB-LTE USB-NATIVE USB-TTL = USBC:USB_C: USB Type C 16Pin Connector Super Speed pins not available on the 16-pin purely SMD connector so this part is best for USB 2.0 implementations. D1 and D2 are tied together enabling D+/- no matter which way the cable is plugged into the connector. The two channel configuration pins (CC1/2) are exposed. These are normally connected to ground via 5.1k resistors but can be reconfigured for high current/high power applications.

## Net classes
0 default: width 0.203 mm
2 gnd: width 0.305 mm, drill 0.559 mm, clearance 0.254 mm
3 usbvcc: width 0.508 mm, drill 0.61 mm, clearance 0.254 mm